# EAGLE schematic termostat_ESP8266 (EAGLE 9.0.1)
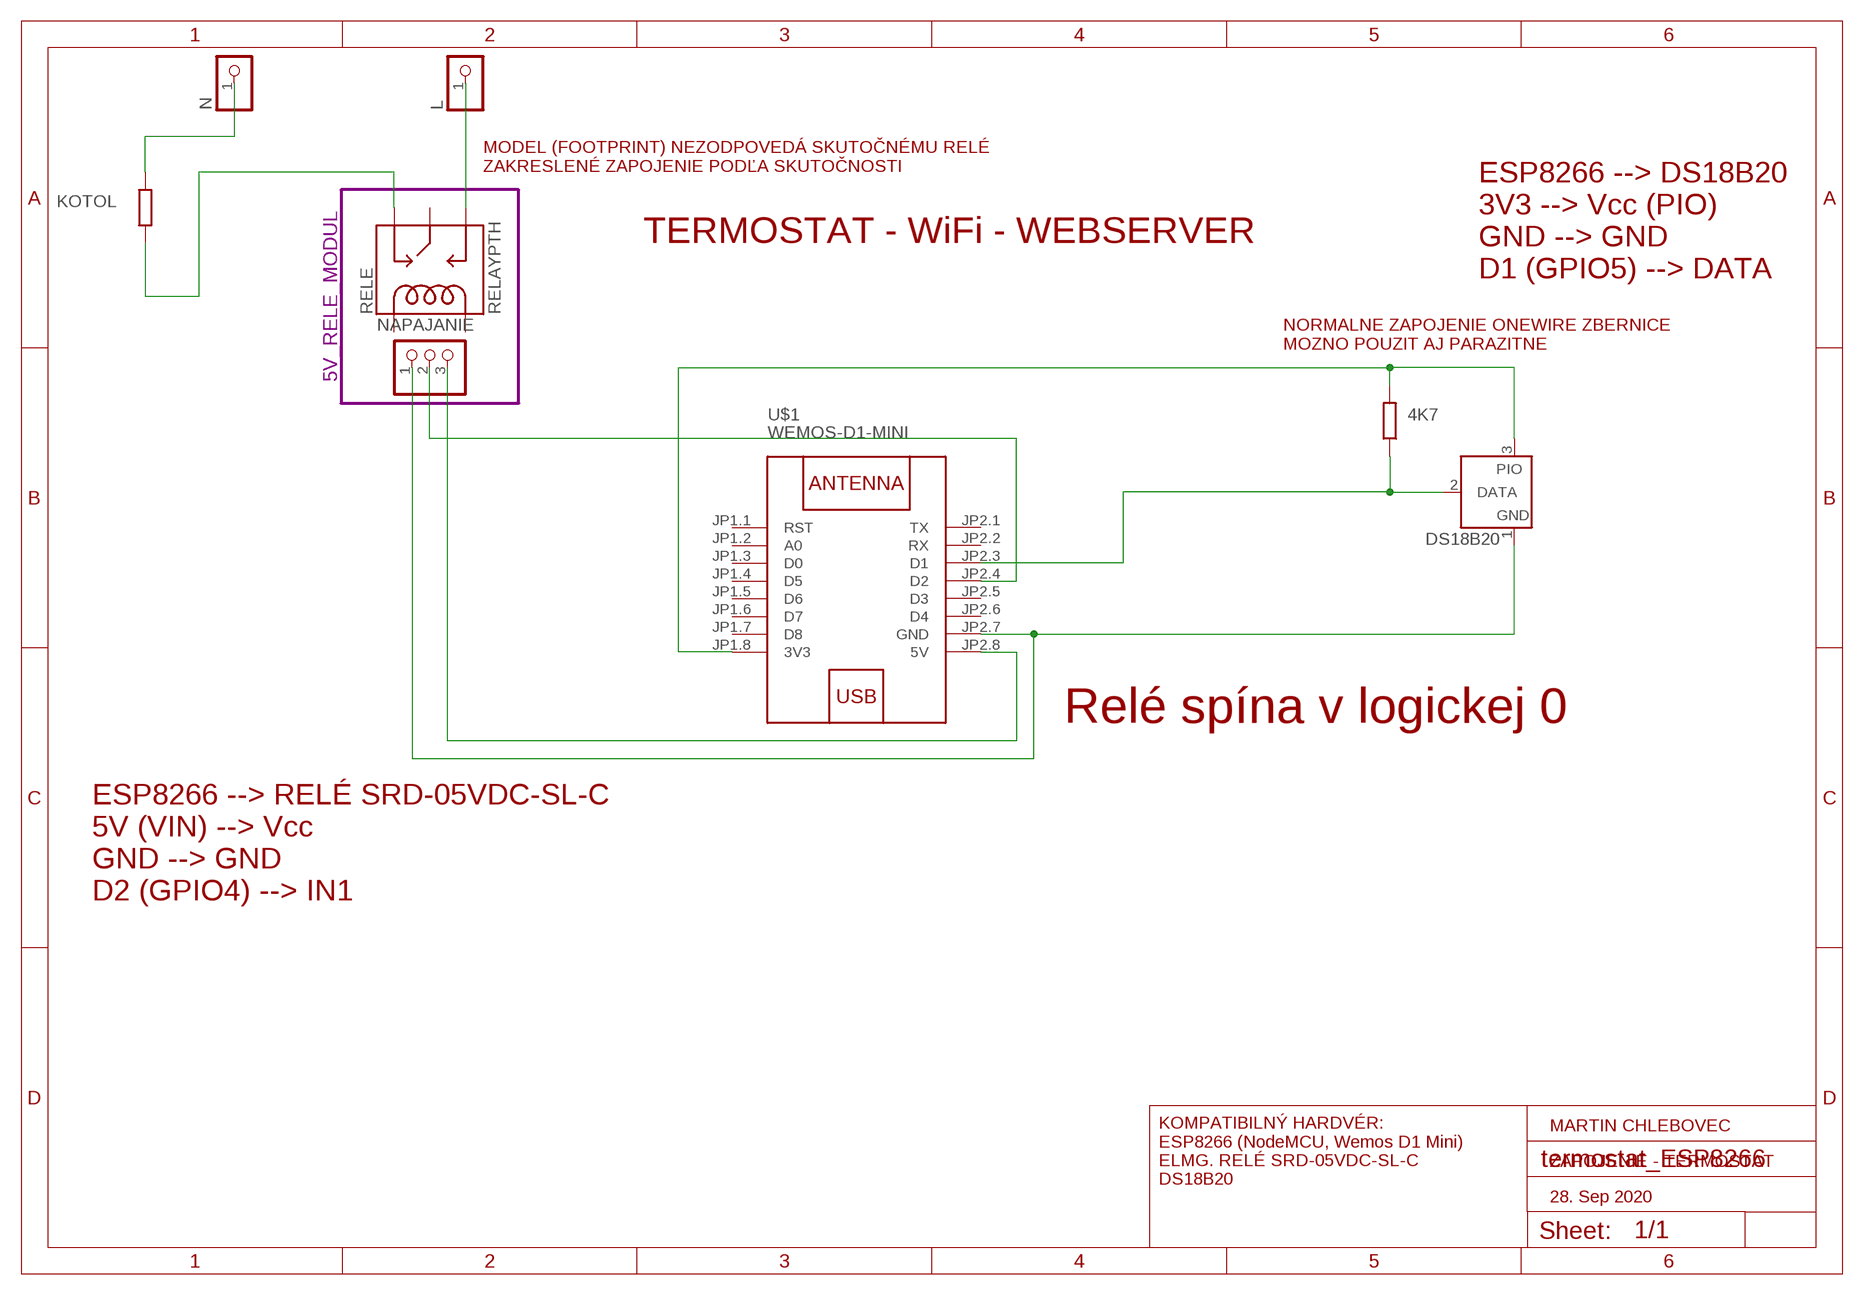
[diagram p0: schematic, sheet 1]

## Parts
IC1  DS2405  [TO92-]
L  PINHD-1X1CB  [1X01-CLEANBIG]
N  PINHD-1X1CB  [1X01-CLEANBIG]
NAPAJANIE  PINHD-1X3  [1X03]
RELE  RELAYPTH  [SRD-05VDC-SL-C]
U$1  WEMOS-D1-MINI  [WEMOS-D1-MINI]

## Module instances
5V_RELE_MODUL = RELE

## Nets
N$1: NAPAJANIE.3 U$1.JP2.8(5V)
N$2: NAPAJANIE.2 U$1.JP2.4(D2)
N$5: IC1.1(GND) NAPAJANIE.1 U$1.JP2.7(GND)
N$8: IC1.2(DATA) U$1.JP2.3(D1)
N$9: IC1.3(PIO) U$1.JP1.8(3V3)
N$11: L.1 RELE.SWOPEN
N$12: N.1
N$13: RELE.SWCLOSED(SWCLOSE)
Unconnected: RELE.COIL0 RELE.COIL1 RELE.SWCOMMON U$1.JP1.1(RST) U$1.JP1.2(A0) U$1.JP1.3(D0) U$1.JP1.4(D5) U$1.JP1.5(D6) U$1.JP1.6(D7) U$1.JP1.7(D8) U$1.JP2.1(TX) U$1.JP2.2(RX) U$1.JP2.5(D3) U$1.JP2.6(D4)

## Notes on the sheet
- MODEL (FOOTPRINT) NEZODPOVEDÁ SKUTOČNÉMU RELÉ
  ZAKRESLENÉ ZAPOJENIE PODĽA SKUTOČNOSTI
- KOTOL
- TERMOSTAT - WiFi - WEBSERVER
- ESP8266 --> DS18B20
  3V3 --> Vcc (PIO)
  GND --> GND
  D1 (GPIO5) --> DATA
- NORMALNE ZAPOJENIE ONEWIRE ZBERNICE
  MOZNO POUZIT AJ PARAZITNE
- 4K7
- DS18B20
- Relé spína v logickej 0
- ESP8266 --> RELÉ SRD-05VDC-SL-C
  5V (VIN) --> Vcc
  GND --> GND
  D2 (GPIO4) --> IN1
- MARTIN CHLEBOVEC
- ZAPOJENIE - TERMOSTAT
- KOMPATIBILNÝ HARDVÉR:
  ESP8266 (NodeMCU, Wemos D1 Mini)
  ELMG. RELÉ SRD-05VDC-SL-C
  DS18B20
- 28. Sep 2020

## Library data of the parts
IC1 = maxim:DS2405: Addressable Switch DALLAS Semiconductor; MF: DALLAS SEMICONDUCTOR; MPN: DS2405; OC_FARNELL: 1188025; OC_NEWARK: 06F4645
L N = adafruit:PINHD-1X1: Pin header 1x1 for 0.1" spacing With round pins
NAPAJANIE = pinhead:PINHD-1X3: PIN HEADER
RELE = SRD-05VDC-SL-C:RELAY: SPDT relay (COM-00101)
U$1 = diy-modules (1):WEMOS-D1-MINI: WEMOS D1 mini: Mini Wi-Fi Board based on ESP-8266 device More details can be found here: https://www.wemos.cc/product/d1-mini.html Click here to find device on ebay.com <http://www.ebay.com/sch/wemos+d1+mini+nodemcu>

## Module LCD
Ports: 

### Library data of the parts

## Module RELE
Ports: 

### Library data of the parts